# EAGLE design xns-ip67-ESP12-New (EAGLE 8.0.2)
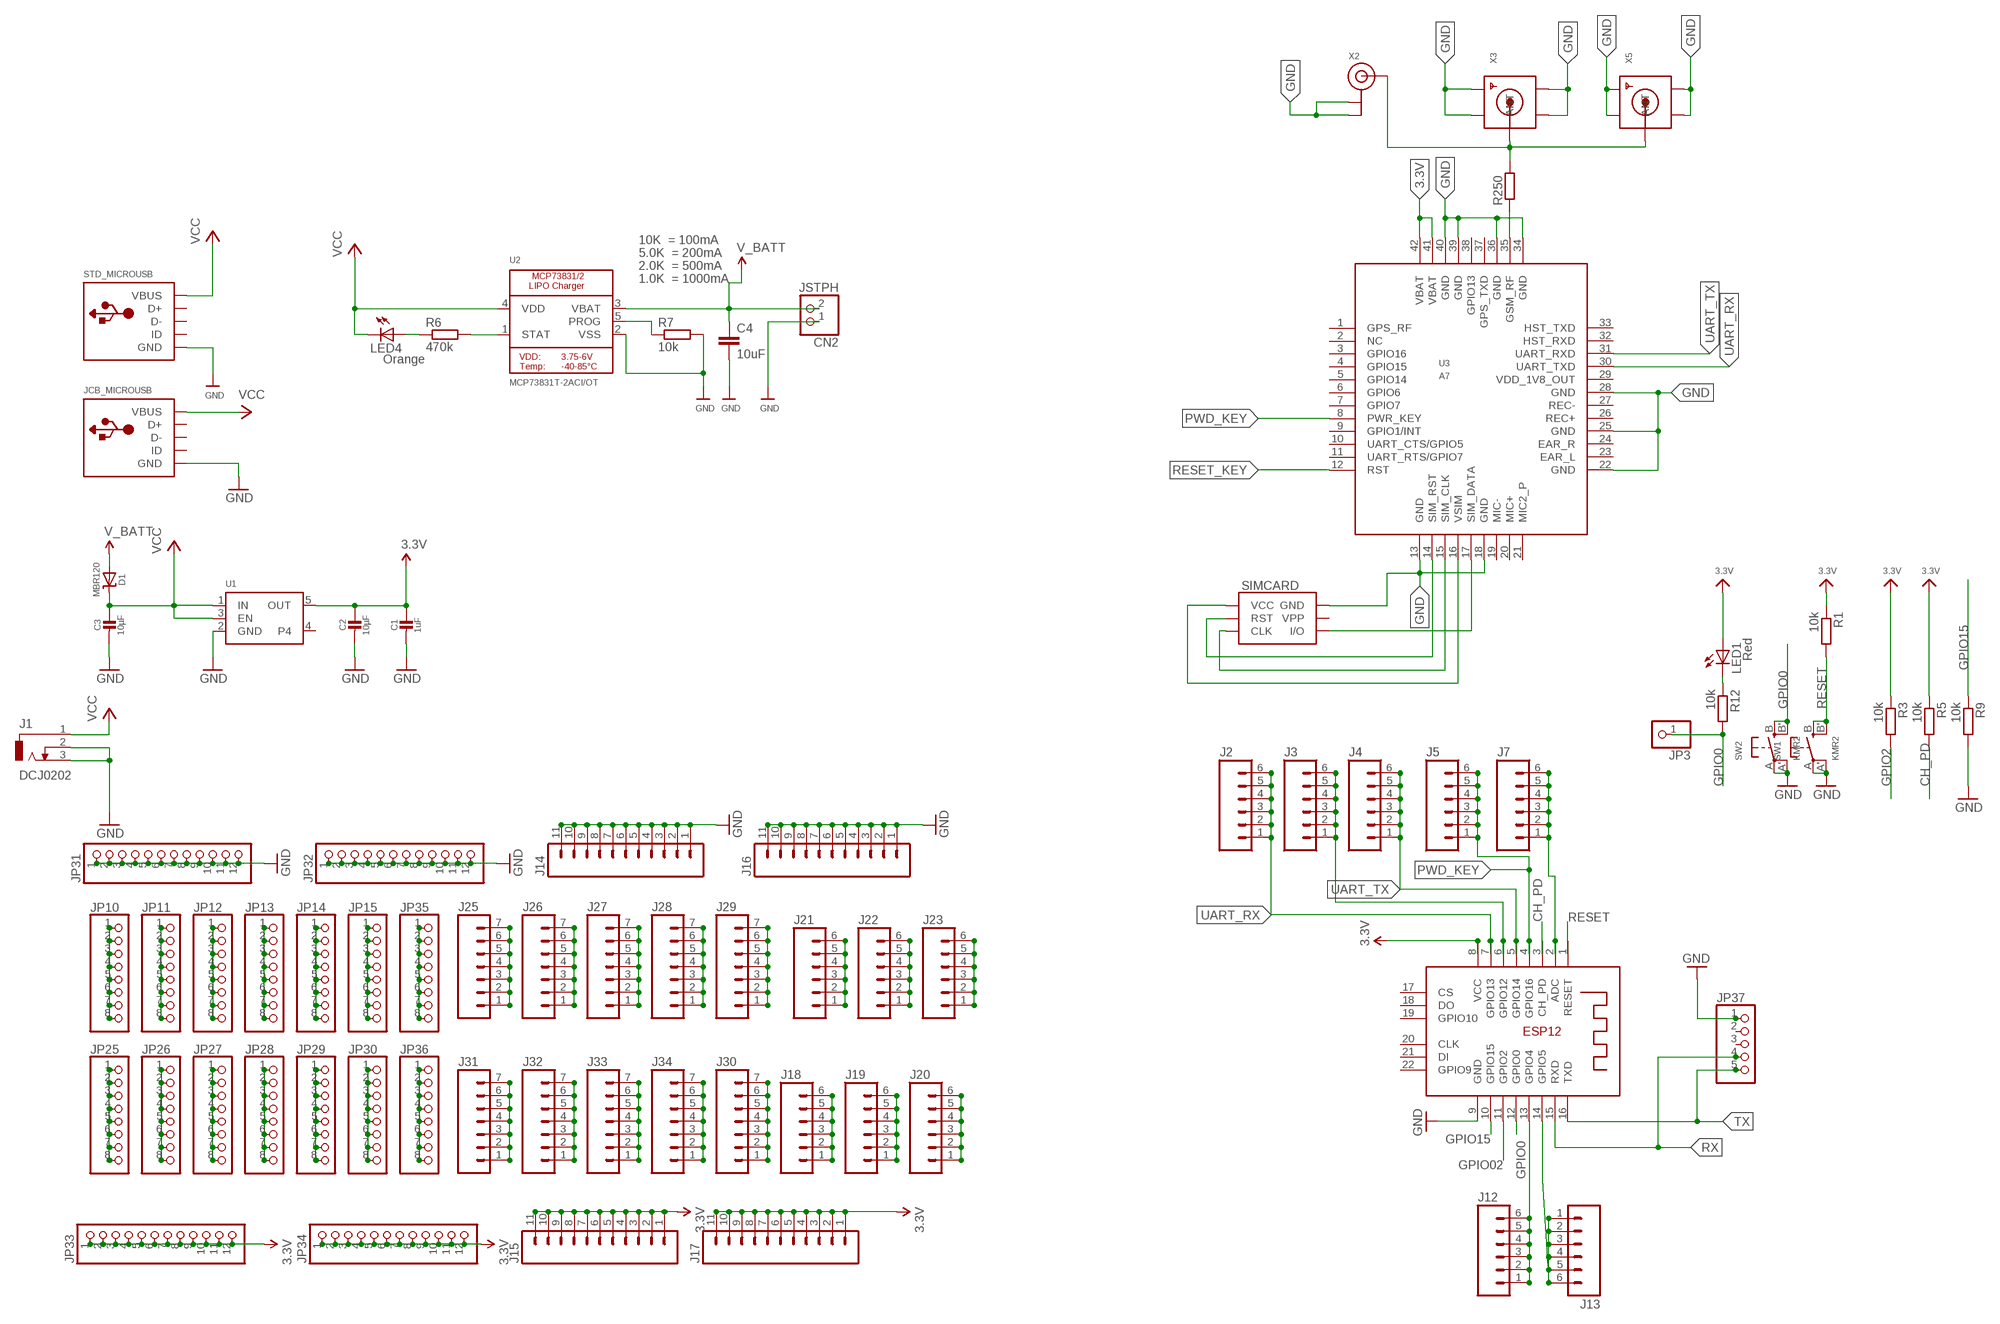
[diagram p0: schematic, sheet 1]

## Parts
C1  1uF  CAP_CERAMIC0603_NO  [0603-NO]
C2  10µF  CAP_CERAMIC0805-NOOUTLINE  [0805-NO]
C3  10µF  CAP_CERAMIC0805-NOOUTLINE  [0805-NO]
C4  10uF  C2.5/2  [C2.5-2]
CN2  JSTPH  JST_2PIN  [JSTPH2]
D1  MBR120  DIODE-SCHOTTKYSOD-123  [SOD-123]
J1  DCJ0202  [DCJ0202]
J2  M06NO_SILK_FEMALE_PTH  [1X06_NO_SILK]
J3  M06NO_SILK_FEMALE_PTH  [1X06_NO_SILK]
J4  M06NO_SILK_FEMALE_PTH  [1X06_NO_SILK]
J5  M06NO_SILK_FEMALE_PTH  [1X06_NO_SILK]
J7  M06NO_SILK_FEMALE_PTH  [1X06_NO_SILK]
J12  M06NO_SILK_FEMALE_PTH  [1X06_NO_SILK]
J13  M06NO_SILK_FEMALE_PTH  [1X06_NO_SILK]
J14  M111X11_NO_SILK  [1X11_NO_SILK]
J15  M111X11_NO_SILK  [1X11_NO_SILK]
J16  M111X11_NO_SILK  [1X11_NO_SILK]
J17  M111X11_NO_SILK  [1X11_NO_SILK]
J18  M06NO_SILK_FEMALE_PTH  [1X06_NO_SILK]
J19  M06NO_SILK_FEMALE_PTH  [1X06_NO_SILK]
J20  M06NO_SILK_FEMALE_PTH  [1X06_NO_SILK]
J21  M06NO_SILK_FEMALE_PTH  [1X06_NO_SILK]
J22  M06NO_SILK_FEMALE_PTH  [1X06_NO_SILK]
J23  M06NO_SILK_FEMALE_PTH  [1X06_NO_SILK]
J25  M07NO_SILK  [1X07_NO_SILK]
J26  M07NO_SILK  [1X07_NO_SILK]
J27  M07NO_SILK  [1X07_NO_SILK]
J28  M07NO_SILK  [1X07_NO_SILK]
J29  M07NO_SILK  [1X07_NO_SILK]
J30  M07NO_SILK  [1X07_NO_SILK]
J31  M07NO_SILK  [1X07_NO_SILK]
J32  M07NO_SILK  [1X07_NO_SILK]
J33  M07NO_SILK  [1X07_NO_SILK]
J34  M07NO_SILK  [1X07_NO_SILK]
JCB_MICROUSB  USB  [USB-MICRO-B]
JP3  PINHD-1X1CB  [1X01-CLEANBIG]
JP10  PINHD-1X8CLEANBIG  [1X08-CLEANBIG]
JP11  PINHD-1X8CLEANBIG  [1X08-CLEANBIG]
JP12  PINHD-1X8CLEANBIG  [1X08-CLEANBIG]
JP13  PINHD-1X8CLEANBIG  [1X08-CLEANBIG]
JP14  PINHD-1X8CLEANBIG  [1X08-CLEANBIG]
JP15  PINHD-1X8CLEANBIG  [1X08-CLEANBIG]
JP25  PINHD-1X8CLEANBIG  [1X08-CLEANBIG]
JP26  PINHD-1X8CLEANBIG  [1X08-CLEANBIG]
JP27  PINHD-1X8CLEANBIG  [1X08-CLEANBIG]
JP28  PINHD-1X8CLEANBIG  [1X08-CLEANBIG]
JP29  PINHD-1X8CLEANBIG  [1X08-CLEANBIG]
JP30  PINHD-1X8CLEANBIG  [1X08-CLEANBIG]
JP31  HEADER-1X12  [1X12_ROUND]
JP32  HEADER-1X12  [1X12_ROUND]
JP33  HEADER-1X12  [1X12_ROUND]
JP34  HEADER-1X12  [1X12_ROUND]
JP35  PINHD-1X8CLEANBIG  [1X08-CLEANBIG]
JP36  PINHD-1X8CLEANBIG  [1X08-CLEANBIG]
JP37  PINHD-1X5  [1X05]
LED1  Red  LED5MM  [LED5MM]
LED4  Orange  LED5MM  [LED5MM]
R1  10k  R0204/7  [0204/7]
R3  10k  R0204/7  [0204/7]
R5  10k  R0204/7  [0204/7]
R6  470k  R0204/7  [0204/7]
R7  10k  R0204/7  [0204/7]
R9  10k  R0204/7  [0204/7]
R12  10k  R0204/7  [0204/7]
R250  R0204/7  [0204/7]
SIMCARD  SIMHOLDERSIM  [SIMHOLDER]
STD_MICROUSB  USB_MICRO_20329_V2  [4UCONN_20329_V2]
SW1  KMR2  SWITCH_TACT_SMT4.6X2.8  [BTN_KMR2_4.6X2.8]
SW2  KMR2  SWITCH_TACT_SMT4.6X2.8  [BTN_KMR2_4.6X2.8]
U1  VREG_SOT23-5  [SOT23-5]
U2  MCP73831T-2ACI/OT  MCP73831/2  [SOT23-5@1]
U3  A7  [A7]
X1  ESP-12E  [ESP-12E]
X2  ANTENNA_U.FL  [U.FL]
X3  SMACONNECTOR_EDGE  [SMA_EDGELAUNCH]
X5  SMACONNECTOR  [SMA90_DIP]

## Nets
3.3V: C1.1 C2.1 J15.1 J15.2 J15.3 J15.4 J15.5 J15.6 J15.7 J15.8 J15.9 J15.10 J15.11 J17.1 J17.2 J17.3 J17.4 J17.5 J17.6 J17.7 J17.8 J17.9 J17.10 J17.11 JP33.1 JP33.2 JP33.3 JP33.4 JP33.5 JP33.6 JP33.7 JP33.8 JP33.9 JP33.10 JP33.11 JP33.12 JP34.1 JP34.2 JP34.3 JP34.4 JP34.5 JP34.6 JP34.7 JP34.8 JP34.9 JP34.10 JP34.11 JP34.12 LED1.A R1.1 R3.1 R5.1 U3.41(VBAT) U3.42(VBAT) X1.8(VCC)
CH_PD: R5.2 X1.3(CH_PD)
GND: C1.2 C2.2 C3.2 C4.2 CN2.1 J1.2 J1.3 J14.1 J14.2 J14.3 J14.4 J14.5 J14.6 J14.7 J14.8 J14.9 J14.10 J14.11 J16.1 J16.2 J16.3 J16.4 J16.5 J16.6 J16.7 J16.8 J16.9 J16.10 J16.11 JCB_MICROUSB.BL1(GND) JCB_MICROUSB.BL2(GND) JCB_MICROUSB.BL3(GND) JCB_MICROUSB.BL4(GND) JCB_MICROUSB.BR1(GND) JCB_MICROUSB.BR2(GND) JCB_MICROUSB.BR3(GND) JCB_MICROUSB.BR4(GND) JCB_MICROUSB.GND JCB_MICROUSB.MTL1(GND) JCB_MICROUSB.MTL2(GND) JCB_MICROUSB.MTR1(GND) JCB_MICROUSB.MTR2(GND) JP31.1 JP31.2 JP31.3 JP31.4 JP31.5 JP31.6 JP31.7 JP31.8 JP31.9 JP31.10 JP31.11 JP31.12 JP32.1 JP32.2 JP32.3 JP32.4 JP32.5 JP32.6 JP32.7 JP32.8 JP32.9 JP32.10 JP32.11 JP32.12 JP37.1 R7.2 R9.2 SIMCARD.C5(GND) STD_MICROUSB.BASE@1(GND) STD_MICROUSB.BASE@2(GND) STD_MICROUSB.GND STD_MICROUSB.SPRT@1(GND) STD_MICROUSB.SPRT@2(GND) STD_MICROUSB.SPRT@3(GND) STD_MICROUSB.SPRT@4(GND) SW1.A'(P1) SW1.A(P) SW2.A'(P1) SW2.A(P) U2.2(VSS) U3.13(GND) U3.18(GND) U3.22(GND) U3.25(GND) U3.28(GND) U3.34(GND) U3.36(GND) U3.39(GND) U3.40(GND) X1.9(GND) X2.1(GND) X2.2(GND) X3.GND@1(GND4) X3.GND@2(GND3) X3.GND@3(GND2) X3.GND@4(GND1)
GPIO0: JP3.1 R12.2 SW2.B'(S1) SW2.B(S) X1.12(GPIO0)
GPIO02: X1.11(GPIO2)
GPIO2: R3.2
GPIO15: R9.1 X1.10(GPIO15)
N$1: R250.1 U3.35(GSM_RF)
N$2: J3.1 J3.2 J3.3 J3.4 J3.5 J3.6 X1.6(GPIO12)
N$3: R250.2 X2.3(SIGNAL) X3.P(ANT) X5.ANTENNA(ANT)
N$4: X5.GND1 X5.GND2
N$5: LED1.K(C) R12.1
N$7: X5.GND3 X5.GND4
N$8: J7.1 J7.2 J7.3 J7.4 J7.5 J7.6 X1.2(ADC)
N$10: SIMCARD.C2(RST) U3.14(SIM_RST)
N$13: SIMCARD.C3(CLK) U3.15(SIM_CLK)
N$14: J12.1 J12.2 J12.3 J12.4 J12.5 J12.6 X1.13(GPIO4)
N$15: J13.1 J13.2 J13.3 J13.4 J13.5 J13.6 X1.14(GPIO5)
N$16: J18.1 J18.2 J18.3 J18.4 J18.5 J18.6
N$17: J19.1 J19.2 J19.3 J19.4 J19.5 J19.6
N$18: J20.1 J20.2 J20.3 J20.4 J20.5 J20.6
N$19: J21.1 J21.2 J21.3 J21.4 J21.5 J21.6
N$20: J22.1 J22.2 J22.3 J22.4 J22.5 J22.6
N$22: SIMCARD.C7(I/O) U3.17(SIM_DATA)
N$23: SIMCARD.C1(VCC) U3.16(VSIM)
N$24: R7.1 U2.5(PROG)
N$30: JP10.1 JP10.2 JP10.3 JP10.4 JP10.5 JP10.6 JP10.7 JP10.8
N$31: JP11.1 JP11.2 JP11.3 JP11.4 JP11.5 JP11.6 JP11.7 JP11.8
N$32: JP12.1 JP12.2 JP12.3 JP12.4 JP12.5 JP12.6 JP12.7 JP12.8
N$33: JP13.1 JP13.2 JP13.3 JP13.4 JP13.5 JP13.6 JP13.7 JP13.8
N$34: JP14.1 JP14.2 JP14.3 JP14.4 JP14.5 JP14.6 JP14.7 JP14.8
N$35: JP15.1 JP15.2 JP15.3 JP15.4 JP15.5 JP15.6 JP15.7 JP15.8
N$36: JP30.1 JP30.2 JP30.3 JP30.4 JP30.5 JP30.6 JP30.7 JP30.8
N$37: JP29.1 JP29.2 JP29.3 JP29.4 JP29.5 JP29.6 JP29.7 JP29.8
N$38: JP28.1 JP28.2 JP28.3 JP28.4 JP28.5 JP28.6 JP28.7 JP28.8
N$39: JP27.1 JP27.2 JP27.3 JP27.4 JP27.5 JP27.6 JP27.7 JP27.8
N$40: JP26.1 JP26.2 JP26.3 JP26.4 JP26.5 JP26.6 JP26.7 JP26.8
N$41: JP25.1 JP25.2 JP25.3 JP25.4 JP25.5 JP25.6 JP25.7 JP25.8
N$50: JP35.1 JP35.2 JP35.3 JP35.4 JP35.5 JP35.6 JP35.7 JP35.8
N$51: JP36.1 JP36.2 JP36.3 JP36.4 JP36.5 JP36.6 JP36.7 JP36.8
N$52: J31.1 J31.2 J31.3 J31.4 J31.5 J31.6 J31.7
N$54: J32.1 J32.2 J32.3 J32.4 J32.5 J32.6 J32.7
N$55: R6.2 U2.1(STAT)
N$56: J33.1 J33.2 J33.3 J33.4 J33.5 J33.6 J33.7
N$58: J34.1 J34.2 J34.3 J34.4 J34.5 J34.6 J34.7
N$59: LED4.A R6.1
N$70: J23.1 J23.2 J23.3 J23.4 J23.5 J23.6
N$71: J25.1 J25.2 J25.3 J25.4 J25.5 J25.6 J25.7
N$72: J26.1 J26.2 J26.3 J26.4 J26.5 J26.6 J26.7
N$73: J27.1 J27.2 J27.3 J27.4 J27.5 J27.6 J27.7
N$74: J28.1 J28.2 J28.3 J28.4 J28.5 J28.6 J28.7
N$75: J29.1 J29.2 J29.3 J29.4 J29.5 J29.6 J29.7
N$76: J30.1 J30.2 J30.3 J30.4 J30.5 J30.6 J30.7
PWD_KEY: J5.1 J5.2 J5.3 J5.4 J5.5 J5.6 U3.8(PWR_KEY) X1.4(GPIO16)
RESET: R1.2 SW1.B'(S1) SW1.B(S) X1.1(RESET)
RESET_KEY: U3.12(RST)
RX: JP37.4 X1.15(RXD)
TX: JP37.5 X1.16(TXD)
UART_RX: J2.1 J2.2 J2.3 J2.4 J2.5 J2.6 U3.30(UART_TXD) X1.7(GPIO13)
UART_TX: J4.1 J4.2 J4.3 J4.4 J4.5 J4.6 U3.31(UART_RXD) X1.5(GPIO14)
V_BATT: C4.1 CN2.2 D1.A U2.3(VBAT)
VCC: C3.1 D1.C J1.1 JCB_MICROUSB.VBUS LED4.K(C) STD_MICROUSB.VBUS U1.1(IN) U1.3(EN) U2.4(VDD)
Unconnected: JCB_MICROUSB.D+ JCB_MICROUSB.D- JCB_MICROUSB.ID JP37.2 JP37.3 SIMCARD.C6(VPP) STD_MICROUSB.D+ STD_MICROUSB.D- STD_MICROUSB.ID U1.4 U1.5(OUT) U3.1(GPS_RF) U3.2(NC) U3.3(GPIO16) U3.4(GPIO15) U3.5(GPIO14) U3.6(GPIO6) U3.7(GPIO7) U3.9(GPIO1/INT) U3.10(UART_CTS/GPIO5) U3.11(UART_RTS/GPIO7) U3.19(MIC-) U3.20(MIC+) U3.21(MIC2_P) U3.23(EAR_L) U3.24(EAR_R) U3.26(REC+) U3.27(REC-) U3.29(VDD_1V8_OUT) U3.32(HST_RXD) U3.33(HST_TXD) U3.37(GPS_TXD) U3.38(GPIO13) X1.17(CS) X1.18(DO) X1.19(GPIO10) X1.20(CLK) X1.21(DI) X1.22(GPIO9)

## Notes on the sheet
- 10K  = 100mA
- 5.0K  = 200mA
- 2.0K  = 500mA
- 1.0K  = 1000mA

## Power pins joined to a net without a drawn wire
GND: U1.2(GND)

## Library data of the parts
C1-C3 = microbuilder:CAP_CERAMIC: Ceramic Capacitors For new designs, use the packages preceded by an '_' character since they are more reliable: The following footprints should be used on most boards: _0402 - Standard footprint for regular board layouts _0603 - Standard footprint for regular board layouts _0805 - Standard footprint for regular board layouts _1206 - Standard footprint for regular board layouts For extremely tight-pitch boards where space is at a premium, the following 'micro-pitch' footprints can be used (smaller pads, no silkscreen outline, etc.): _0402MP - Micro-pitch footprint for very dense/compact boards _0603MP - Micro-pitch footprint for very dense/compact boards _0805MP - Micro-pitch footprint for very dense/compact boards _1206MP - Micro-pitch footprint for very dense/compact boards
C4 = capacitor-wima:C: CAPACITOR naming: grid - package width
CN2 = microbuilder:JST_2PIN: JST 2-Pin Right-Angle Connector PH-Series - 4UConnector: 17311 SH-Series - 4UConnector: 07278
D1 = microbuilder:DIODE-SCHOTTKY
J1 = con-jack:DCJ0202: DC POWER JACK Source: DCJ0202.pdf; OC_FARNELL: unknown; OC_NEWARK: unknown
J2-J5 J7 J12 J13 J18-J23 = SparkFun-Connectors:M06: Header 6 Standard 6-pin 0.1" header. Use with straight break away headers (SKU : PRT-00116), right angle break away headers (PRT-00553), swiss pins (PRT-00743), machine pins (PRT-00117), and female headers (PRT-00115). Molex polarized connector foot print use with SKU : PRT-08094 with associated crimp pins and housings. NOTES ON THE VARIANTS LOCK and LOCK_LONGPADS... This footprint was designed to help hold the alignment of a through-hole component (i.e. 6-pin header) while soldering it into place. You may notice that each hole has been shifted either up or down by 0.005 of an inch from it's more standard position (which is a perfectly straight line). This slight alteration caused the pins (the squares in the middle) to touch the edges of the holes. Because they are alternating, it causes a "brace" to hold the component in place. 0.005 has proven to be the perfect amount of "off-center" position when using our standard breakaway headers. Although looks a little odd when you look at the bare footprint, once you have a header in there, the alteration is very hard to notice. Also,if you push a header all the way into place, it is covered up entirely on the bottom side. This idea of altering the position of holes to aid alignment will be further integrated into the Sparkfun Library for other footprints. It can help hold any component with 3 or more connection pins.; PROD_ID: CONN-08437
J14-J17 = SparkFun-Connectors:M11: Header 11 Standard 11-pin 0.1" header. Use with straight break away headers (SKU : PRT-00116), right angle break away headers (PRT-00553), swiss pins (PRT-00743), machine pins (PRT-00117), and female headers (PRT-00115).
J25-J34 = SparkFun-Connectors:M07: Header 7 Standard 7-pin 0.1" header. Use with straight break away headers (SKU : PRT-00116), right angle break away headers (PRT-00553), swiss pins (PRT-00743), machine pins (PRT-00117), and female headers (PRT-00115). NOTES ON THE VARIANTS LOCK and LOCK_LONGPADS... This footprint was designed to help hold the alignment of a through-hole component (i.e. 7-pin header) while soldering it into place. You may notice that each hole has been shifted either up or down by 0.005 of an inch from it's more standard position (which is usually a perfectly straight line). This slight alteration caused the pins (the squares in the middle) to touch the edges of the holes. Because they are alternating, it causes a "brace" to hold the header in place. 0.005 has proven to be the perfect amount of "off-center" position when using our standard breakaway headers. Although looks a little odd when you look at the bare footprint, once you have a header in there, the alteration is very hard to notice. Also, if you push a header all the way into place, it is covered up entirely on the bottom side. This idea of altering the position of holes to aid alignment will be further integrated into the Sparkfun Library for other footprints. It can help hold any component with 3 or more connection pins.
JCB_MICROUSB = jcbrataas-2:USB: MOLEX USB, Micro-B - Surface Mount Female Micro-B USB Connector Source: Molex - Data sheet <http://www.molex.com/pdm_docs/sd/1054431101_sd.pdf> Created by: mochini77©2017 <https://www.fiverrr.com/mochini77>
JP3 = adafruit:PINHD-1X1: Pin header 1x1 for 0.1" spacing With round pins
JP10-JP15 JP25-JP30 JP35 JP36 = adafruit:PINHD-1X8: PIN HEADER
JP31-JP34 = microbuilder:HEADER-1X12
JP37 = pinhead:PINHD-1X5: PIN HEADER
LED1 LED4 = adafruit:LED: LED OSRAM: - CHIPLED LG R971, LG N971, LY N971, LG Q971, LY Q971, LO R971, LY R971 LH N974, LH R974 LS Q976, LO Q976, LY Q976 LO Q996 - Hyper CHIPLED LW Q18S LB Q993, LB Q99A, LB R99A - SideLED LS A670, LO A670, LY A670, LG A670, LP A670 LB A673, LV A673, LT A673, LW A673 LH A674 LY A675 LS A676, LA A676, LO A676, LY A676, LW A676 LS A679, LY A679, LG A679 - Hyper Micro SIDELED® LS Y876, LA Y876, LO Y876, LY Y876 LT Y87S - SmartLED LW L88C, LW L88S LB L89C, LB L89S, LG L890 LS L89K, LO L89K, LY L89K LS L896, LA L896, LO L896, LY L896 - TOPLED LS T670, LO T670, LY T670, LG T670, LP T670 LSG T670, LSP T670, LSY T670, LOP T670, LYG T670 LG T671, LOG T671, LSG T671 LB T673, LV T673, LT T673, LW T673 LH T674 LS T676, LA T676, LO T676, LY T676, LB T676, LH T676, LSB T676, LW T676 LB T67C, LV T67C, LT T67C, LS T67K, LO T67K, LY T67K, LW E67C LS E67B, LA E67B, LO E67B, LY E67B, LB E67C, LV E67C, LT E67C LW T67C LS T679, LY T679, LG T679 LS T770, LO T770, LY T770, LG T770, LP T770 LB T773, LV T773, LT T773, LW T773 LH T774 LS E675, LA E675, LY E675, LS T675 LS T776, LA T776, LO T776, LY T776, LB T776 LHGB T686 LT T68C, LB T68C - Hyper Mini TOPLED® LB M676 - Mini TOPLED Santana® LG M470 LS M47K, LO M47K, LY M47K Source: http://www.osram.convergy.de/
R1 R3 R5-R7 R9 R12 R250 = eagle-ltspice:R: RESISTOR, European symbol; SPICEMODEL: NONE; SPICEPREFIX: R
SIMCARD = SparkFun-Connectors:SIMHOLDER: SIM Socket Socket for SIM cellular cards. Schematic element and footprint production proven. Spark Fun Electronics SKU : PRT-00548; PROD_ID: CONN-08536
STD_MICROUSB = microbuilder:USB: USB Connectors USBMINIB - Surface Mount Female Mini-B USB Connector 4UConnector: 06564
SW1 SW2 = microbuilder:SWITCH_TACT_SMT: SMT Tact Switches 6x6mm - Digikey: P12940SCT-ND KMR2 (4.6x2.8mm) - Digikey: 401-1426-1-ND EVQ-PQHB55 - Light Touch, 160GF (4.5x4.5mm) - Digikey: P8090SCT-ND KMT0 - KMT021 NGJ LHS (etc.) IP68/Waterproof - Digikey: CKN10289CT-ND
U1 = microbuilder:VREG_SOT23-5: SOT23-5 Fixed Voltage Regulators Part Current Out V Out V In V Dropout θJA (°C/W) TJ (°C) Digikey Part No. ADP121 150mA 3.3V 3.4-5.5V 0.09V @ 150mA -- -- ADP121-AUJZ33R7CT-ND ADP121 150mA 3.0V 3.1-5.5V 0.09V @ 150mA -- -- ADP121-AUJZ30R7CT-ND ADP122 300mA 3.3V 3.4-5.5V 0.085V @ 300mA -- -- ADP122AUJZ-3.3-R7CT-ND ADP1712 300mA 3.3V 3.5-5.5V 0.17V @ 300mA -- -- ADP1712AUJZ-3.3-R7TR-ND AP7311 (Low Cost) 150mA 3.3V 3.5-6V 0.15V @ 150mA -- -- AP7311-33WG-7DICT-ND LD39015M18R 150mA 1.8V 1.9V-5.5V 0.08V @ 100mA -- -- 497-6977-1-ND LP2985A-33DBVR 150mA 3.3V 3.3-16V 0.28V @ 150mA 206 150 296-18479-1-ND MCP1824T-3302E/OT 300mA 3.3V 3.5V-6V 0.2V @ 300mA -- -- MCP1824T-3302E/OTCT-ND MIC5205-2.5YM5 TR 150mA 2.5V 2.7-16V 0.165V @ 150mA -- -- 576-1257-2-ND MIC5205-3.0YM5 TR 150mA 3.0V 3.2V-16V 0.165V @ 150mA -- -- 576-1258-2-ND MIC5205-3.3YM5 TR 150mA 3.3V 3.5V-16V 0.165V @ 150mA -- -- 576-1259-2-ND TPS780330220 150mA 3.3V+2.2V 3.6-5.5V 250mV Max -- -- 296-23332-1-ND TDA3663/N1,135 100mA 3.3V 3.5-45V 0.18V @ 50mA -- -- 568-5343-1-ND Max operating temp can be calculated using θJA, TJ (max junction temperature), and power in watts. Set the "Maximum Ambient Temperature" until it reaches TJ ("Max Junction Temperature"), which is the absolute limit for safe use of the regulator: Heat Sink Temperature Calculator <http://www.daycounter.com/Calculators/Heat-Sink-Temperature-Calculator.phtml> For example, With 12V source into a 3.3V LP2985 and a 30mA load, we are dissipating (12V-3.3V) * 0.03A = 0.261W. With a θJA of 206 °C/W, a TJ of 150°C, and 261mW we can safely use the chip without a heat sink up to 75°C (=147.1°C Junction Temperature).
U2 = microbuilder:MCP73831/2: MCP73831/2 LIPO Charger VDD: 3.75 - 6V Temp -40 - 85°C Programmable Charge Rate: 15-500mA NOTE: STAT is a tri-state logic output on the MCP73831 and an open-drain output on the MCP73832. SOT23-5 with 4.2V output and tri-state logic on STAT = MCP73831T-2ACI/OT
U3 = IC:A7
X1 = microbuilder:ESP-12E
X2 = adafruit:ANTENNA_U.FL: U.FL Antenna Connector
X3 X5 = adafruit:SMACONNECTOR: SMA Connector 90° DIP SMA Connector, 50 Ohm (4UConnector: 07259)

## Board
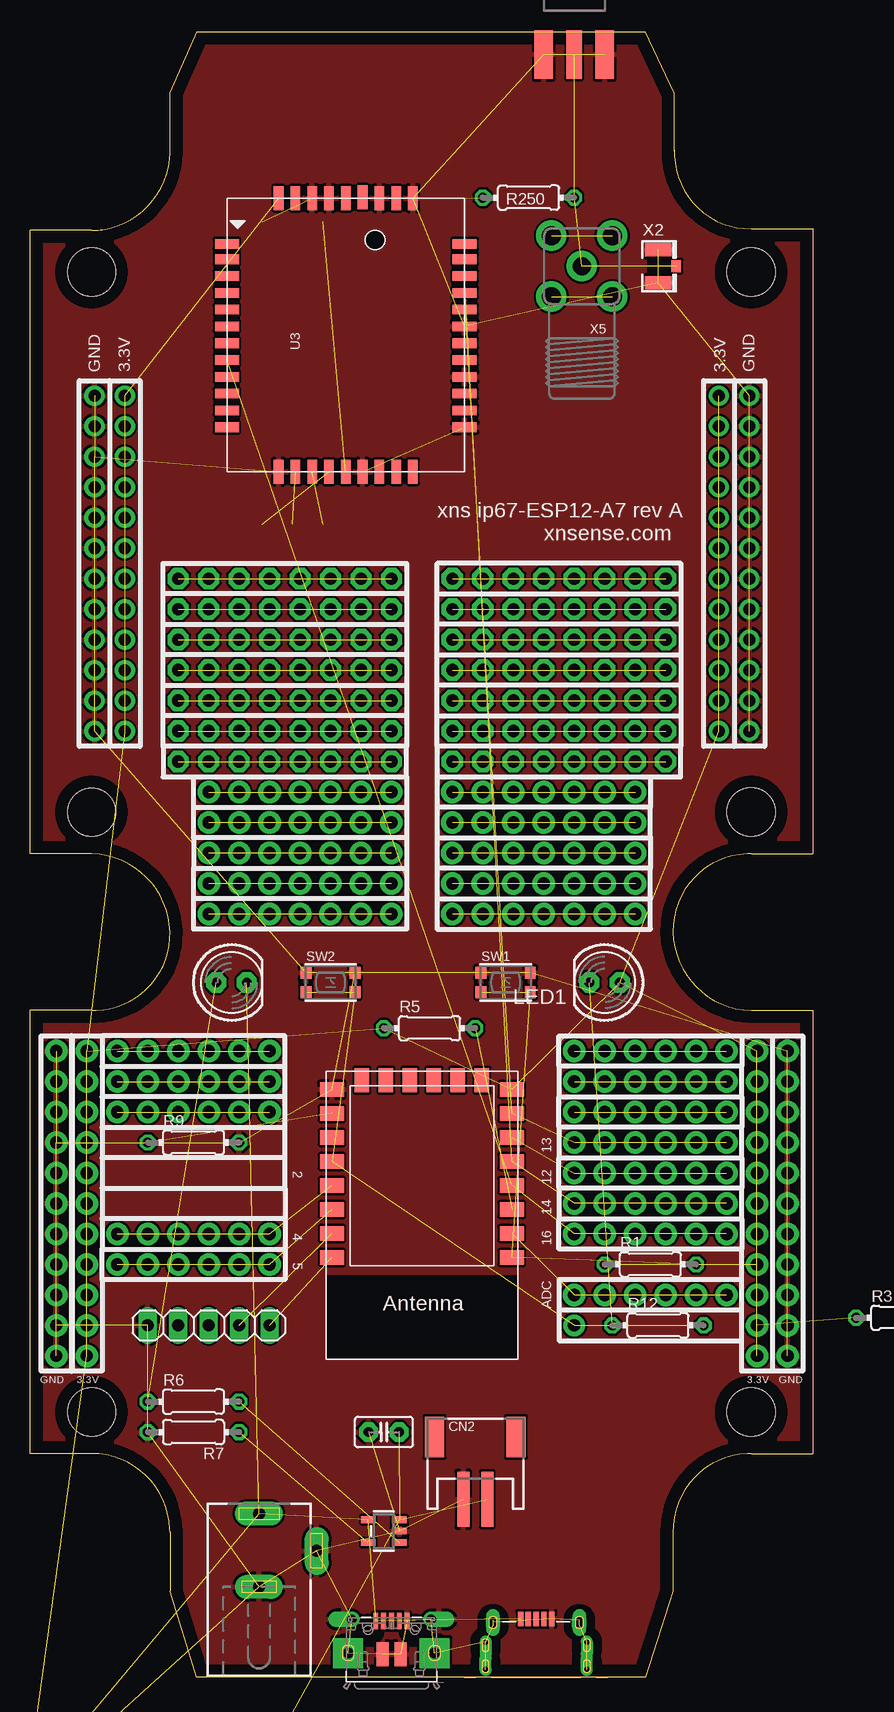
[diagram p1: board, top side]
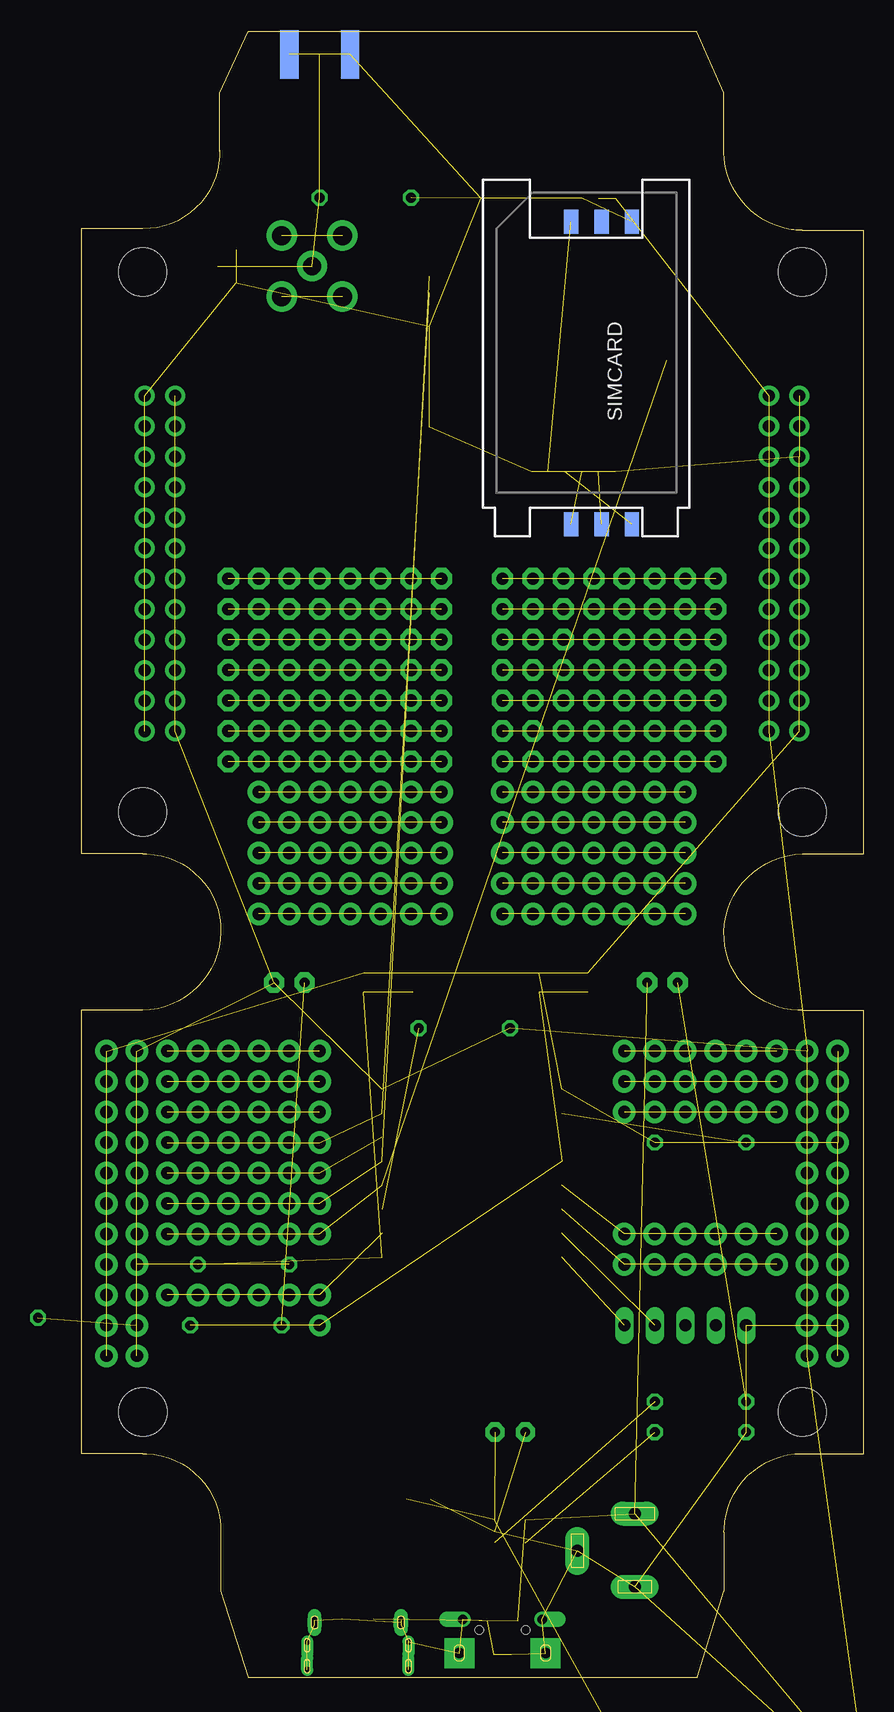
[diagram p2: board, bottom side, seen from below]

Size 65.26 x 137.16 mm. Coordinates in mm from the lower left corner, seen from the top.
Outline: 53.72,127.17 53.72,132.03 51.33,137.16 13.93,137.16 11.68,132.06 11.68,127.11 arc-80 6.05,120.65 arc-7 5.5,120.6 5.14,120.59 0.01,120.59 0.01,68.64 5.14,68.64 arc-87 11.67,62.12 arc-90 5.5,55.59 5.14,55.58 0,55.58 0,18.65 5.13,18.65 arc-88 11.66,12.37 11.67,12.11 11.67,7.17
Outline: 53.73,127.28 arc2 53.74,126.78 arc88 60.13,120.72 65.26,120.72 65.26,68.63 60.14,68.63
Outline: 60.13,68.63 59.81,68.62 arc89 53.62,62.12 arc88 60.13,55.59 65.26,55.59 65.26,18.64 60.13,18.64 59.82,18.63 arc89 53.62,12.09 53.62,7.17 51.33,0 13.9,0 11.67,7.17
Outline: 11.67,7.17 11.67,7.16
Copper layers (1*16): Top 0.035mm / dielectric 1.5mm / Bottom 0.035mm
Design rules "default *": minimum track width 0.5mm, minimum drill 20mil, track to track 8mil, track to pad 8mil, pad to pad 8mil, via to via 8mil, smd to smd 8mil, copper to edge 40mil, drill to drill 8mil, minimum pad ring 10mil, minimum via ring 8mil, stop-mask expansion 4mil, vias tented up to drill 0mil, thermal gap 10mil
Holes 4 mm at 5.14,117.11 60.13,117.12 5.14,72.1 60.13,72.11 5.14,22.12 60.12,22.12

### Footprints (pad centres in the part's own frame; a part is rotated, then mirrored left to right if it is on the bottom)
0603-NO = smd 1.1 x 1: 1 -0.85,0; 2 0.85,0
0805-NO = smd 1.24 x 1.5: 1 -0.95,0; 2 0.95,0
C2.5-2 = drill 0.813 pad 1.6 octagon: 1 -1.27,0; 2 1.27,0
JSTPH2 = smd 1 x 4.6: 1 -1,-3.7; 2 1,-3.7 | smd 1.6 x 3.4: NC1 -3.4,1.5; NC2 3.4,1.5
SOD-123 = smd 1.4 x 1.4: A 1.85,0; C -1.85,0
DCJ0202 = drill 1 pad 2 long: 1 0,3.1; 2 4.8,0; 3 0,-3
1X06_NO_SILK = drill 1.016 pad 1.88: 1 0,0; 2 2.54,0; 3 5.08,0; 4 7.62,0; 5 10.16,0; 6 12.7,0
1X11_NO_SILK = drill 1.016 pad 1.88: 1 0,0; 2 2.54,0; 3 5.08,0; 4 7.62,0; 5 10.16,0; 6 12.7,0; 7 15.24,0; 8 17.78,0; 9 20.32,0; 10 22.86,0; 11 25.4,0
1X07_NO_SILK = drill 1.016 pad 1.88: 1 0,0; 2 2.54,0; 3 5.08,0; 4 7.62,0; 5 10.16,0; 6 12.7,0; 7 15.24,0
USB-MICRO-B = drill 0.6 pad 1.2: BL1 -3.6,2.75; BL2 -3.6,2.35; BR1 3.6,2.75; BR2 3.6,2.35 | drill 0.6 pad 1.2 octagon: BL3 -3.6,2.55; BR3 3.6,2.55 | drill 0.6 pad 0.8 long: BL4 -3.6,2.55; BR4 3.6,2.55 | smd 0.45 x 1.2: D+ 0,2.85; D- -0.65,2.85; GND 1.3,2.85; ID 0.65,2.85; VBUS -1.3,2.85 | drill 0.5 offset: MTL1 -4.225,0.95; MTL2 -4.225,-1.4; MTR1 4.225,0.95; MTR2 4.225,-1.4
1X01-CLEANBIG = drill 1.016 pad 1.778: 1 0,0
1X08-CLEANBIG = drill 1.016 pad 1.778 octagon: 1 -8.89,0; 2 -6.35,0; 3 -3.81,0; 4 -1.27,0; 5 1.27,0; 6 3.81,0; 7 6.35,0; 8 8.89,0
1X12_ROUND = drill 1 pad 1.676: 1 -13.97,0; 2 -11.43,0; 3 -8.89,0; 4 -6.35,0; 5 -3.81,0; 6 -1.27,0; 7 1.27,0; 8 3.81,0; 9 6.35,0; 10 8.89,0; 11 11.43,0; 12 13.97,0
1X05 = drill 1.016 long: 1 -5.08,0; 2 -2.54,0; 3 0,0; 4 2.54,0; 5 5.08,0
LED5MM = drill 0.813 pad 1.676 octagon: A -1.27,0; K 1.27,0
0204/7 = drill 0.813 octagon: 1 -3.81,0; 2 3.81,0
SIMHOLDER = smd 2 x 1.2: C1 -12.61,-3.81; C2 -12.61,-1.27; C3 -12.61,1.27; C5 12.61,-3.81; C6 12.61,-1.27; C7 12.61,1.27
4UCONN_20329_V2 = smd 1 x 2: BASE@1 -0.75,-2; BASE@2 0.75,-2 | smd 0.4 x 1.35: D+ 0,0.775; D- -0.65,0.775; GND 1.3,0.775; ID 0.65,0.775; VBUS -1.3,0.775 | drill 0.8 pad 1.2 offset: SPRT@1 -3.3,0.9; SPRT@2 3.3,0.9 | drill 0.9 pad 2.5 square: SPRT@3 -3.6,-1.9; SPRT@4 3.6,-1.9 | hole 0.7: -1.95,0; 1.95,0
BTN_KMR2_4.6X2.8 = smd 0.9 x 1: A 2.05,0.8; A' -2.05,0.8; B 2.05,-0.8; B' -2.05,-0.8
SOT23-5 = smd 0.55 x 1.2: 1 -0.95,-1.3; 2 0,-1.3; 3 0.95,-1.3; 4 0.95,1.3; 5 -0.95,1.3
SOT23-5@1 = smd 0.55 x 1.2: 1 -0.95,-1.3; 2 0,-1.3; 3 0.95,-1.3; 4 0.95,1.3; 5 -0.95,1.3
A7 = smd 0.8 x 2: 1 7.57,9.9; 2 6.3,9.9; 3 4.9,9.9; 4 3.5,9.9; 5 2.1,9.9; 6 0.7,9.9; 7 -0.7,9.9; 8 -2.1,9.9; 9 -3.5,9.9; 10 -4.9,9.9; 11 -6.3,9.9; 12 -7.7,9.9; 22 -7.7,-9.9; 23 -6.3,-9.9; 24 -4.9,-9.9; 25 -3.5,-9.9; 26 -2.1,-9.9; 27 -0.7,-9.9; 28 0.7,-9.9; 29 2.1,-9.9; 30 3.5,-9.9; 31 4.9,-9.9; 32 6.3,-9.9; 33 7.57,-9.9 | smd 2 x 0.8: 13 -11.4,5.6; 14 -11.4,4.2; 15 -11.4,2.8; 16 -11.4,1.4; 17 -11.4,0; 18 -11.4,-1.4; 19 -11.4,-2.8; 20 -11.4,-4.2; 21 -11.4,-5.6; 34 11.4,-5.6; 35 11.4,-4.2; 36 11.4,-2.8; 37 11.46,-1.4; 38 11.4,0; 39 11.4,1.4; 40 11.4,2.8; 41 11.4,4.2; 42 11.4,5.6
ESP-12E = smd 2 x 1.2: 1 -7.5,5.77; 2 -7.5,3.77; 3 -7.5,1.77; 4 -7.5,-0.23; 5 -7.5,-2.23; 6 -7.5,-4.23; 7 -7.5,-6.23; 8 -7.5,-8.23; 9 7.5,-8.23; 10 7.5,-6.23; 11 7.5,-4.23; 12 7.5,-2.23; 13 7.5,-0.23; 14 7.5,1.77; 15 7.5,3.77; 16 7.5,5.77 | smd 1.2 x 2: 17 -5,-9; 18 -3,-9; 19 -1,-9; 20 1,-9; 21 3,-9; 22 5,-9
U.FL = smd 2.2 x 1.05: 1 0,1.375; 2 0,-1.375 | smd 0.8 x 1: 3 1.525,0
SMA_EDGELAUNCH = smd 4.064 x 1.524: GND@1 2.032,-2.54; GND@2 2.032,2.54 | smd 4.064 x 1.524 bottom: GND@3 2.032,2.54; GND@4 2.032,-2.54 | smd 4.064 x 1.27: P 2.032,0
SMA90_DIP = drill 1.5 pad 2.54: ANTENNA 0,0 | drill 1.6 pad 2.54: GND1 -2.54,2.54; GND2 2.54,2.54; GND3 -2.54,-2.54; GND4 2.54,-2.54

### Placement (x,y rotation side)
C1  -5.42,-52.59 0 top  (outside the outline)
C2  -6.06,-56.39 0 top  (outside the outline)
C3  -6.06,-61.48 0 top  (outside the outline)
C4  29.51,20.44 180 top
CN2  37.12,18.54 0 top
D1  -5.42,-48.77 0 top  (outside the outline)
J1  19.1,10.55 0 top
J2  45.38,44.57 0 top
J3  45.38,42.03 0 top
J4  45.38,39.49 0 top
J5  45.38,36.95 0 top
J7  45.38,31.87 0 top
J12  7.28,36.95 0 top
J13  7.28,34.41 0 top
J14  2.2,26.79 90 top
J15  4.74,26.79 90 top
J16  63.16,26.79 90 top
J17  60.62,26.79 90 top
J18  7.28,52.19 0 top
J19  7.28,49.65 0 top
J20  7.28,47.11 0 top
J21  45.38,52.19 0 top
J22  45.38,49.65 0 top
J23  45.38,47.11 0 top
J25  14.9,73.78 0 top
J26  14.9,71.24 0 top
J27  14.9,68.7 0 top
J28  14.9,66.16 0 top
J29  14.9,63.62 0 top
J30  35.22,73.78 0 top
J31  35.22,71.24 0 top
J32  35.22,68.7 0 top
J33  35.22,66.16 0 top
J34  35.22,63.62 0 top
JCB_MICROUSB  42.2,2.02 0 top
JP3  45.38,29.33 0 top
JP10  21.25,91.56 0 top
JP11  21.25,89.02 0 top
JP12  21.25,86.48 0 top
JP13  21.25,83.94 0 top
JP14  21.25,81.4 0 top
JP15  21.25,78.86 0 top
JP25  44.11,78.86 0 top
JP26  44.11,81.4 0 top
JP27  44.11,83.94 0 top
JP28  44.11,86.48 0 top
JP29  44.11,89.02 0 top
JP30  44.11,91.56 0 top
JP31  5.38,92.83 90 top
JP32  59.99,92.83 90 top
JP33  57.45,92.83 90 top
JP34  7.91,92.83 90 top
JP35  21.25,76.32 0 top
JP36  44.11,76.32 0 top
JP37  14.9,29.33 0 top
LED1  47.92,57.91 180 top
LED4  16.8,57.91 0 top
R1  51.73,34.41 0 top
R3  72.68,29.96 0 top  (outside the outline)
R5  33.32,54.09 0 top
R6  13.63,22.98 0 top
R7  13.63,20.44 180 top
R9  13.63,44.57 0 top
R12  52.37,29.33 0 top
R250  41.57,123.31 0 top
SIMCARD  23.16,108.7 90 bottom
STD_MICROUSB  30.14,3.93 0 top
SW1  39.66,57.91 0 top
SW2  25.06,57.91 0 top
U1  -6.06,-13.85 0 top  (outside the outline)
U2  29.51,12.19 90 top
U3  26.33,111.88 90 top
X1  32.68,40.76 180 top
X2  52.37,117.59 0 top
X3  45.38,137.28 270 top
X5  46.02,117.59 180 top

### Tracks (layer width: path | path; a pad name or v marks a point on that pad's centre or on a via)
3.3V  (54 unrouted)
CH_PD  (1 unrouted)
GND  (96 unrouted)
  pour Top: -0.34,139.82 65.7,139.82 65.7,-1.15 -0.34,-1.15
GPIO0  (4 unrouted)
GPIO15  (1 unrouted)
N$1  (1 unrouted)
N$2  (6 unrouted)
N$3  (3 unrouted)
N$4  (1 unrouted)
N$5  (1 unrouted)
N$7  (1 unrouted)
N$8  (6 unrouted)
N$10  (1 unrouted)
N$13  (1 unrouted)
N$14  (6 unrouted)
N$15  (6 unrouted)
N$16  (5 unrouted)
N$17  (5 unrouted)
N$18  (5 unrouted)
N$19  (5 unrouted)
N$20  (5 unrouted)
N$22  (1 unrouted)
N$23  (1 unrouted)
N$24  (1 unrouted)
N$30  (7 unrouted)
N$31  (7 unrouted)
N$32  (7 unrouted)
N$33  (7 unrouted)
N$34  (7 unrouted)
N$35  (7 unrouted)
N$36  (7 unrouted)
N$37  (7 unrouted)
N$38  (7 unrouted)
N$39  (7 unrouted)
N$40  (7 unrouted)
N$41  (7 unrouted)
N$50  (7 unrouted)
N$51  (7 unrouted)
N$52  (6 unrouted)
N$54  (6 unrouted)
N$55  (1 unrouted)
N$56  (6 unrouted)
N$58  (6 unrouted)
N$59  (1 unrouted)
N$70  (5 unrouted)
N$71  (6 unrouted)
N$72  (6 unrouted)
N$73  (6 unrouted)
N$74  (6 unrouted)
N$75  (6 unrouted)
N$76  (6 unrouted)
PWD_KEY  (7 unrouted)
RESET  (3 unrouted)
RX  (1 unrouted)
TX  (1 unrouted)
UART_RX  (7 unrouted)
UART_TX  (7 unrouted)
V_BATT  (3 unrouted)
VCC  (8 unrouted)

### Text on the board
tNames: GND | 3.3V | 3.3V | GND | xns ip67-ESP12-A7 rev A | xnsense.com | 13 | 2 | 12 | 14 | 4 | 16 | 5 | ADC | GND | 3.3V | 3.3V | GND
tValues: GND | RX | TX